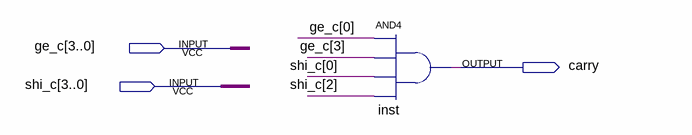
[diagram p0: schematic sheet]
// Quartus schematic cay.bdf as structural Verilog: 1 symbols, 3 pins
module cay (
  input  [3:0] ge_c,
  input  [3:0] shi_c,
  output carry
);

  and inst (carry, ge_c[0], ge_c[3], shi_c[0], shi_c[2]);
endmodule
